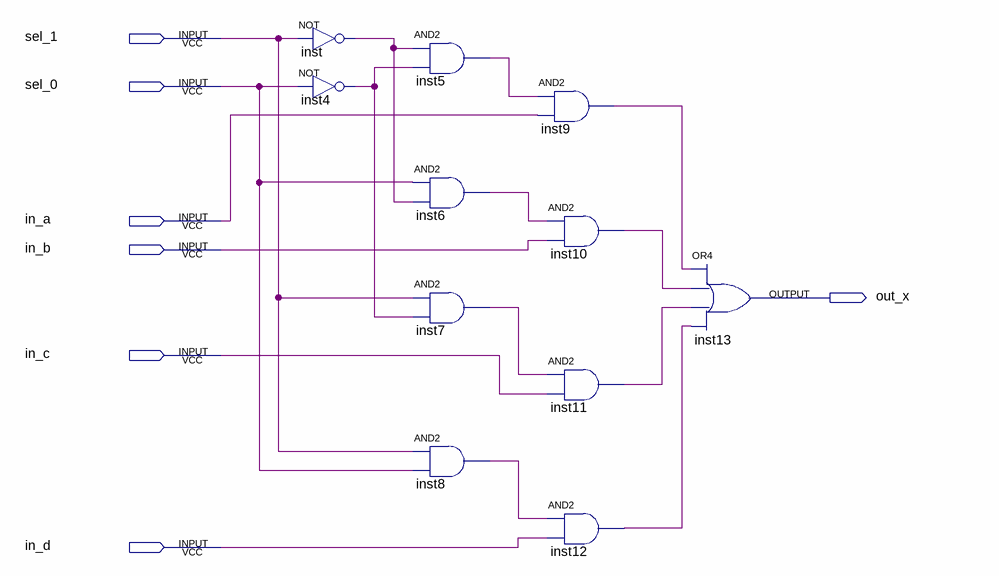
[diagram p0: schematic sheet]
// Quartus schematic multiplexador.bdf as structural Verilog: 11 symbols, 7 pins
module multiplexador (
  input  sel_1,
  input  sel_0,
  input  in_a,
  input  in_b,
  input  in_c,
  input  in_d,
  output out_x
);

  wire inst4_out, inst5_out, inst6_out, inst7_out, inst8_out, inst9_out, inst10_out, inst11_out, inst12_out,
       inst_out;

  not inst (inst_out, sel_1);
  not inst4 (inst4_out, sel_0);
  and inst5 (inst5_out, inst_out, inst4_out);
  and inst6 (inst6_out, sel_0, inst_out);
  and inst7 (inst7_out, sel_1, inst4_out);
  and inst8 (inst8_out, sel_1, sel_0);
  and inst9 (inst9_out, inst5_out, in_a);
  and inst10 (inst10_out, inst6_out, in_b);
  and inst11 (inst11_out, inst7_out, in_c);
  and inst12 (inst12_out, inst8_out, in_d);
  or inst13 (out_x, inst9_out, inst10_out, inst11_out, inst12_out);
endmodule
